# Altium schematic sheet Fuse_Science_PDB_MCU.SchDoc
size A3; SheetNumber: 4; SheetTotal: 8
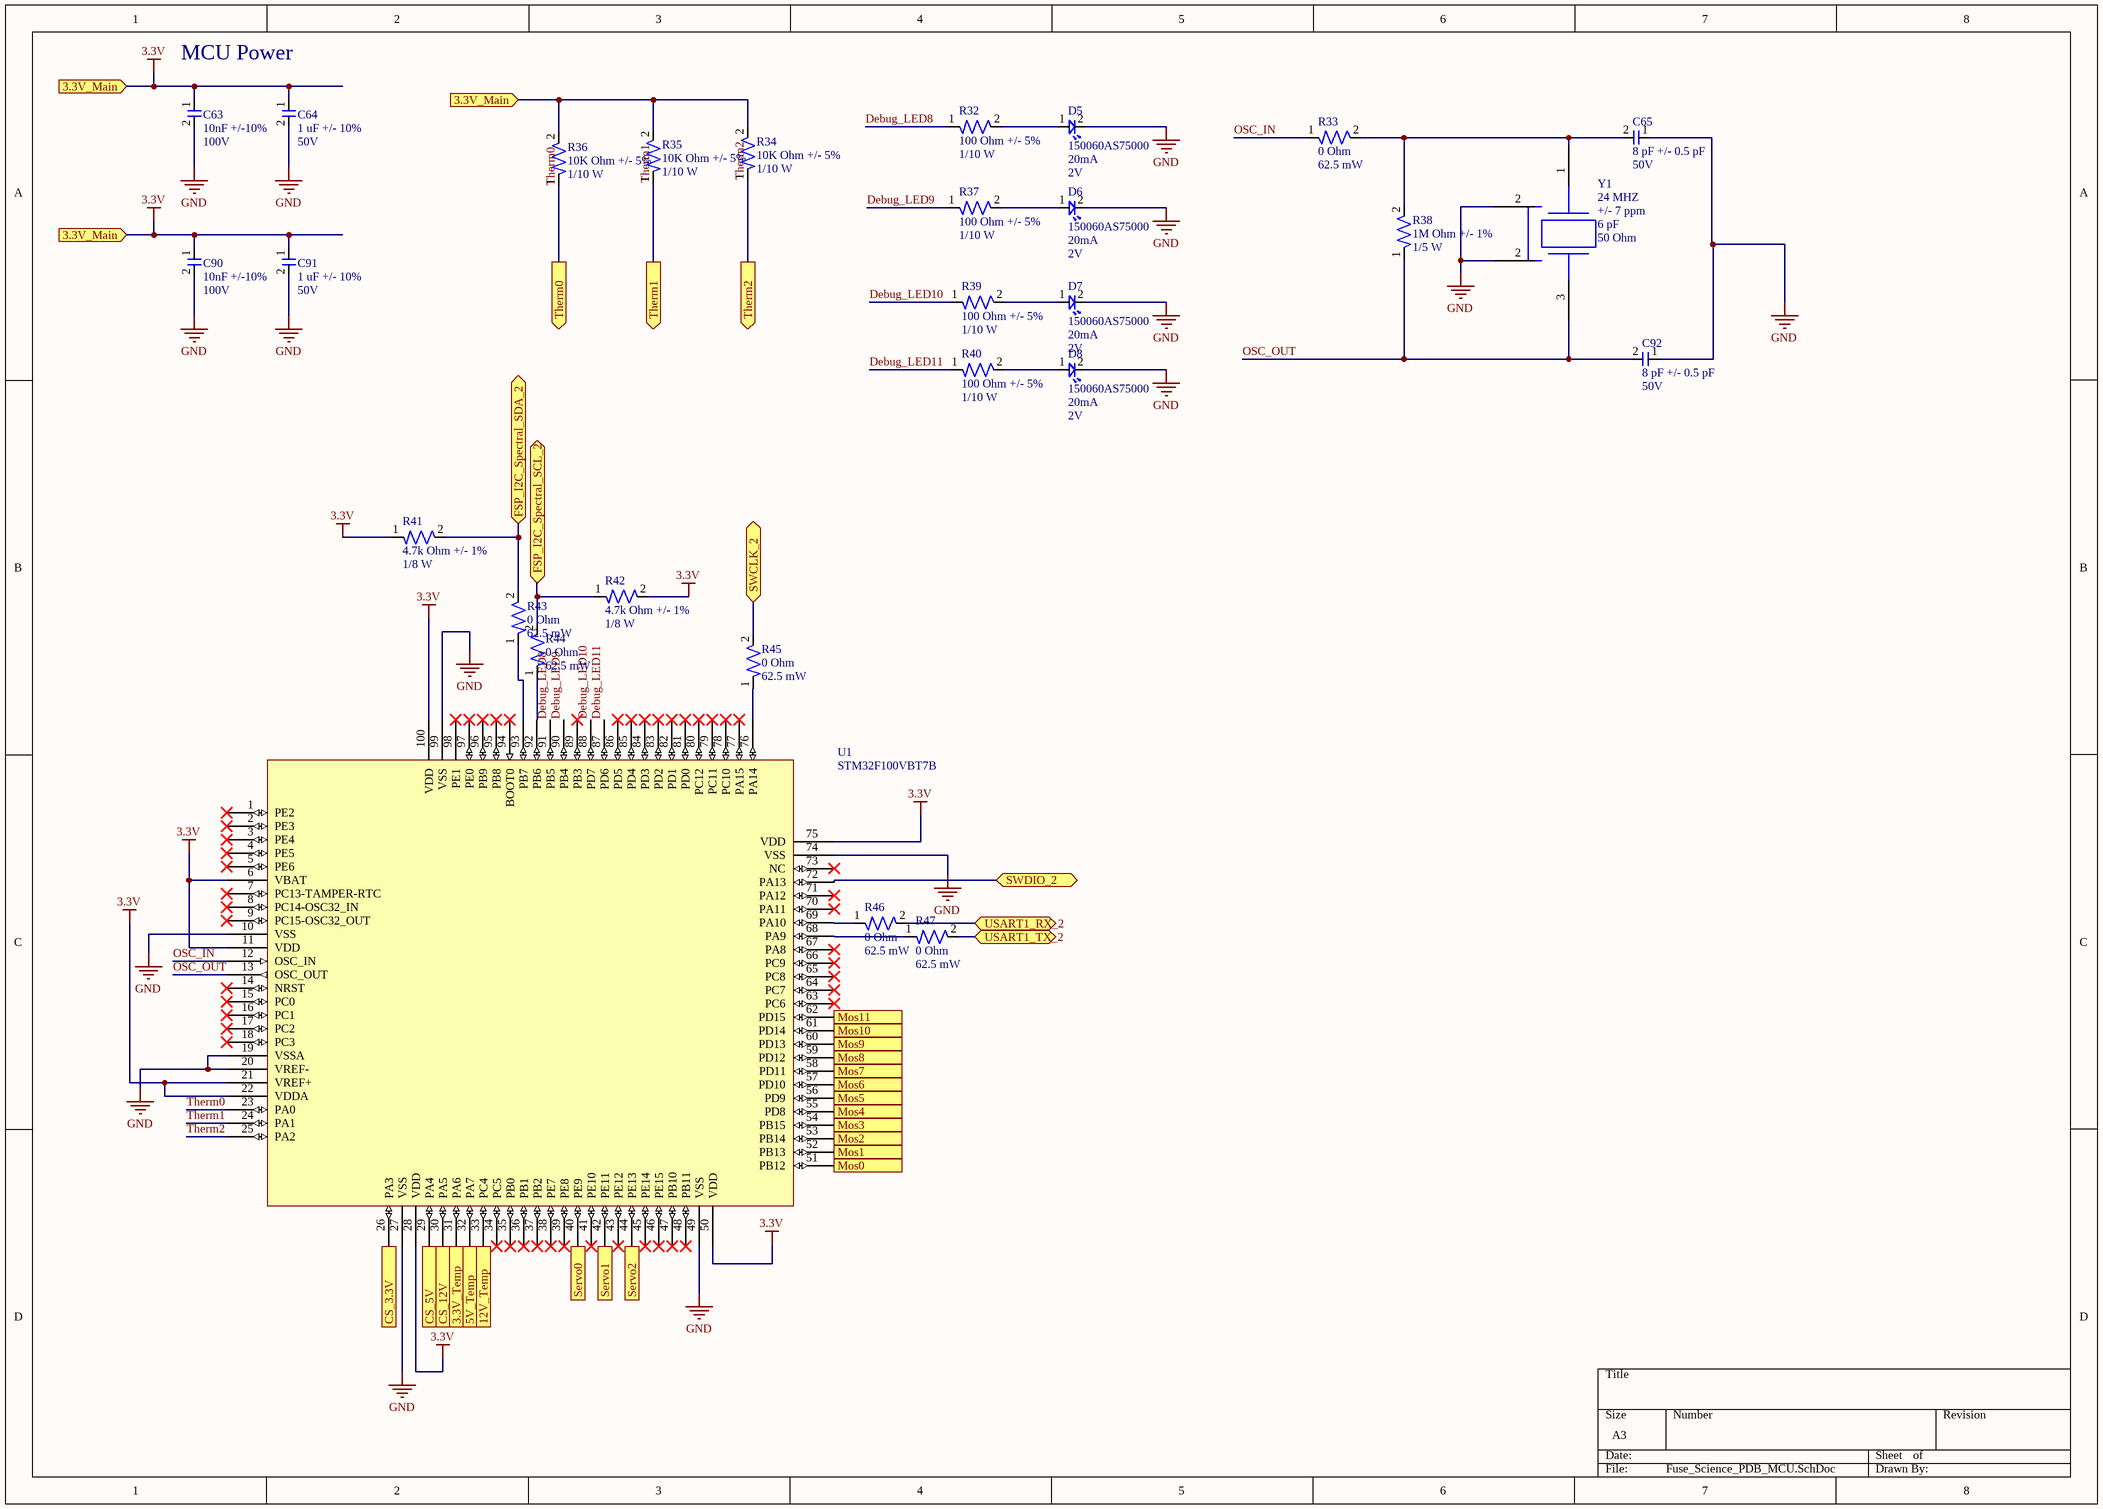
[diagram p0: Fuse_Science_PDB_MCU.SchDoc]

## Parts
C63  Capacitance: 10nF +/-10%  Voltage Rating: 100V  [CAP-0603]  (hidden comment: CC0603KRX7R0BB103)
C64  Cap: 1 uF +/- 10%  Voltage: 50V  [CAP-0805]  (hidden comment: GCM21BR71H105KA03L)
C65  Capaitance: 8 pF +/- 0.5 pF  Parameter 2: 50V  [CAP-0402]  (hidden comment: CC0402DRNPO9BN8R0)
C90  Capacitance: 10nF +/-10%  Voltage Rating: 100V  [CAP-0603]  (hidden comment: CC0603KRX7R0BB103)
C91  Cap: 1 uF +/- 10%  Voltage: 50V  [CAP-0805]  (hidden comment: GCM21BR71H105KA03L)
C92  Capaitance: 8 pF +/- 0.5 pF  Parameter 2: 50V  [CAP-0402]  (hidden comment: CC0402DRNPO9BN8R0)
D5  150060AS75000  Current Rating: 20mA  Vf: 2V  [LED-0603]
D6  150060AS75000  Current Rating: 20mA  Vf: 2V  [LED-0603]
D7  150060AS75000  Current Rating: 20mA  Vf: 2V  [LED-0603]
D8  150060AS75000  Current Rating: 20mA  Vf: 2V  [LED-0603]
R32  Resistance: 100 Ohm +/- 5%  Power: 1/10 W  [RES-0402]  (hidden comment: ERJ2GEJ101X)
R33  Resistance: 0 Ohm  Power: 62.5 mW  [RES-0402]  (hidden comment: RC0402FR-070RL)
R34  Resistance: 10K Ohm +/- 5%  Power: 1/10 W  [RES-0402]  (hidden comment: ERJ2GEJ103X)
R35  Resistance: 10K Ohm +/- 5%  Power: 1/10 W  [RES-0402]  (hidden comment: ERJ2GEJ103X)
R36  Resistance: 10K Ohm +/- 5%  Power: 1/10 W  [RES-0402]  (hidden comment: ERJ2GEJ103X)
R37  Resistance: 100 Ohm +/- 5%  Power: 1/10 W  [RES-0402]  (hidden comment: ERJ2GEJ101X)
R38  Resistance: 1M Ohm +/- 1%  Power: 1/5 W  [RES-0402]  (hidden comment: ERJPA2F1004X)
R39  Resistance: 100 Ohm +/- 5%  Power: 1/10 W  [RES-0402]  (hidden comment: ERJ2GEJ101X)
R40  Resistance: 100 Ohm +/- 5%  Power: 1/10 W  [RES-0402]  (hidden comment: ERJ2GEJ101X)
R41  Resistance: 4.7k Ohm +/- 1%  Power: 1/8 W  [RES-0402]  (hidden comment: RC0402FR-7W4K7L)
R42  Resistance: 4.7k Ohm +/- 1%  Power: 1/8 W  [RES-0402]  (hidden comment: RC0402FR-7W4K7L)
R43  Resistance: 0 Ohm  Power: 62.5 mW  [RES-0402]  (hidden comment: RC0402FR-070RL)
R44  Resistance: 0 Ohm  Power: 62.5 mW  [RES-0402]  (hidden comment: RC0402FR-070RL)
R45  Resistance: 0 Ohm  Power: 62.5 mW  [RES-0402]  (hidden comment: RC0402FR-070RL)
R46  Resistance: 0 Ohm  Power: 62.5 mW  [RES-0402]  (hidden comment: RC0402FR-070RL)
R47  Resistance: 0 Ohm  Power: 62.5 mW  [RES-0402]  (hidden comment: RC0402FR-070RL)
U1  STM32F100VBT7B  [IC-STM32F100-0001]
Y1  Frequency: 24 MHZ  Frequency Tolerance: +/- 7 ppm  Load Capacitance: 6 pF  Equavalence Series Resistance: 50 Ohm  [CRYSTAL-4-SMD-0001]  (hidden comment: ECS-240-6-37B-7KM-TR)

## Ports
3.3V_Main (in), 3.3V_Temp (in), 5V_Temp (in), 12V_Temp (in), CS_3.3V (in), CS_5V (in), CS_12V (in), FSP_I2C_Spectral_SCL_2 (bidir), FSP_I2C_Spectral_SDA_2 (bidir), Mos0 (out), Mos1 (out), Mos2 (out), Mos3 (out), Mos4 (out), Mos5 (out), Mos6 (out), Mos7 (out), Mos8 (out), Mos9 (out), Mos10 (out), Mos11 (out), Servo0 (out), Servo1 (out), Servo2 (out), SWCLK_2 (bidir), SWDIO_2 (bidir), Therm0 (out), Therm1 (out), Therm2 (out), USART1_RX_2 (bidir), USART1_TX_2 (bidir)

## Nets
3.3V: C63.1 C64.1 C90.1 C91.1 R34.2 R35.2 R36.2 R41.1 R42.2 U1.6(VBAT) U1.11(VDD) U1.21(VREF+) U1.22(VDDA) U1.28(VDD) U1.50(VDD) U1.75(VDD) U1.100(VDD) ; port 3.3V_Main
GND: C63.2 C64.2 C65.1 C90.2 C91.2 C92.1 D5.2 D6.2 D7.2 D8.2 U1.10(VSS) U1.19(VSSA) U1.20(VREF-) U1.27(VSS) U1.49(VSS) U1.74(VSS) U1.99(VSS) Y1.2
3.3V_Temp: U1.31(PA6) ; port 3.3V_Temp
5V_Temp: U1.32(PA7) ; port 5V_Temp
12V_Temp: U1.33(PC4) ; port 12V_Temp
CS_3.3V: U1.26(PA3) ; port CS_3.3V
CS_5V: U1.29(PA4) ; port CS_5V
CS_12V: U1.30(PA5) ; port CS_12V
Debug_LED8: R32.1 U1.91(PB5)
Debug_LED9: R37.1 U1.90(PB4)
Debug_LED10: R39.1 U1.88(PD7)
Debug_LED11: R40.1 U1.87(PD6)
FSP_I2C_Spectral_SCL_2: R42.1 R44.2 ; port FSP_I2C_Spectral_SCL_2
FSP_I2C_Spectral_SDA_2: R41.2 R43.2 ; port FSP_I2C_Spectral_SDA_2
Mos0: U1.51(PB12) ; port Mos0
Mos1: U1.52(PB13) ; port Mos1
Mos2: U1.53(PB14) ; port Mos2
Mos3: U1.54(PB15) ; port Mos3
Mos4: U1.55(PD8) ; port Mos4
Mos5: U1.56(PD9) ; port Mos5
Mos6: U1.57(PD10) ; port Mos6
Mos7: U1.58(PD11) ; port Mos7
Mos8: U1.59(PD12) ; port Mos8
Mos9: U1.60(PD13) ; port Mos9
Mos10: U1.61(PD14) ; port Mos10
Mos11: U1.62(PD15) ; port Mos11
OSC_IN: R33.1 U1.12(OSC_IN)
OSC_OUT: C92.2 R38.1 U1.13(OSC_OUT) Y1.3
Servo0: U1.40(PE9) ; port Servo0
Servo1: U1.42(PE11) ; port Servo1
Servo2: U1.44(PE13) ; port Servo2
SWCLK_2: R45.2 ; port SWCLK_2
SWDIO_2: U1.72(PA13) ; port SWDIO_2
Therm0: R36.1 U1.23(PA0) ; port Therm0
Therm1: R35.1 U1.24(PA1) ; port Therm1
Therm2: R34.1 U1.25(PA2) ; port Therm2
USART1_RX_2: R46.2 ; port USART1_RX_2
USART1_TX_2: R47.2 ; port USART1_TX_2
NetC65_2: C65.2 R33.2 R38.2 Y1.1
NetD5_1: D5.1 R32.2
NetD6_1: D6.1 R37.2
NetD7_1: D7.1 R39.2
NetD8_1: D8.1 R40.2
NetR43_1: R43.1 U1.93(PB7)
NetR44_1: R44.1 U1.92(PB6)
NetR45_1: R45.1 U1.76(PA14)
NetR46_1: R46.1 U1.69(PA10)
NetR47_1: R47.1 U1.68(PA9)

Not connected (* = marked no-connect by the designer): U1 1(PE2)* 2(PE3)* 3(PE4)* 4(PE5)* 5(PE6)* 7(PC13-TAMPER-RTC)* 8(PC14-OSC32_IN)* 9(PC15-OSC32_OUT)* 14(NRST)* 15(PC0)* 16(PC1)* 17(PC2)* 18(PC3)* 34(PC5)* 35(PB0)* 36(PB1)* 37(PB2)* 38(PE7)* 39(PE8)* 41(PE10)* 43(PE12)* 45(PE14)* 46(PE15)* 47(PB10)* 48(PB11)* 63(PC6)* 64(PC7)* 65(PC8)* 66(PC9)* 67(PA8)* 70(PA11)* 71(PA12)* 73(NC)* 77(PA15)* 78(PC10)* 79(PC11)* 80(PC12)* 81(PD0)* 82(PD1)* 83(PD2)* 84(PD3)* 85(PD4)* 86(PD5)* 89(PB3)* 94(BOOT0)* 95(PB8)* 96(PB9)* 97(PE0)* 98(PE1)*

## Notes on the sheet
- MCU Power

## Library data of the parts
C63 C90 = CAP-10N-0003-JLC: 100V 10nF X7R ±10% 0603 Multilayer Ceramic Capacitors MLCC - SMD/SMT ROHS; Manufacturer: Yageo; Assembled?: yes; Manufacturer Part Number: CC0603KRX7R0BB103; Temperature Coefficient: X7R; Package Size: 0603; JLC Part Number: C107059
C64 C91 = CAP-1U-0003-JLC: 50V 1uF X7R ±10% 0805 Multilayer Ceramic Capacitors MLCC - SMD/SMT ROHS; assembled?: yes; JLC Part Number: C126592
C65 C92 = CAP-8P-0002-JLC: 50V 8pF NP0 ±0.5pF 0402 Multilayer Ceramic Capacitors MLCC - SMD/SMT ROHS; assembled: yes; JLC part number: C327227
D5-D8 = LED_Amber_0001: CAP CER 0.1UF 100V X7R 0603; Manufacturer: Wurth Electronik; Assembled?: no; Color: Amber; Manufacturer Part Number: 150060AS75000; Package Size: 0603
R32 R37 R39 R40 = RES-100-0003-JLC: 100mW Thick Film Resistors ±5% ±200ppm/℃ -55℃~+155℃ 100Ω 0402  Chip Resistor - Surface Mount ROHS; assembled?: yes; JLC part number: C412972
R33 R43-R47 = RES-0-0002-JLC: 62.5mW Thick Film Resistors 50V -55℃~+155℃ 0Ω 0402 Chip Resistor - Surface Mount ROHS; assembled?: yes; JLC part number: C106231
R34-R36 = RES-10K-0003-JLC: 100mW Thick Film Resistors 100V ±5% ±200ppm/℃ -55℃~+155℃ 10kΩ 0402  Chip Resistor - Surface Mount ROHS; assembled?: yes; JLC part number: C278577
R38 = RES-1M-0002-JLC: 1/5W ±100ppm/℃ ±1% -55℃~+155℃ 1MΩ 0402 Chip Resistor - Surface Mount ROHS; assembled?: yes; JLC part number: C427259
R41 R42 = RES-4.7K-0003-JLC: 125mW Thick Film Resistors 50V ±1% ±200ppm/℃ -55℃~+155℃ 4.7kΩ 0402  Chip Resistor - Surface Mount ROHS; assembled?: yes; JLC part number: C606173
U1 = IC-STM32F100-0001: ARM® Cortex®-M3 STM32F1 Microcontroller IC 32-Bit Single-Core 24MHz 128KB (128K x 8) FLASH 100-LQFP (14x14); VCC: 2 ~ 3.6V; Manufacturer Part Number: STM32F100VBT7B; Package Size: 100-LQFP
Y1 = CRYSTAL-24MHz-0001: 24 MHz ±7ppm Crystal 6pF 50 Ohms 4-SMD, No Lead; Manufacturer: ECS Inc.; Manufacturer Part Number: ECS-240-6-37B-7KM-TR; Package Size: 4-SMD